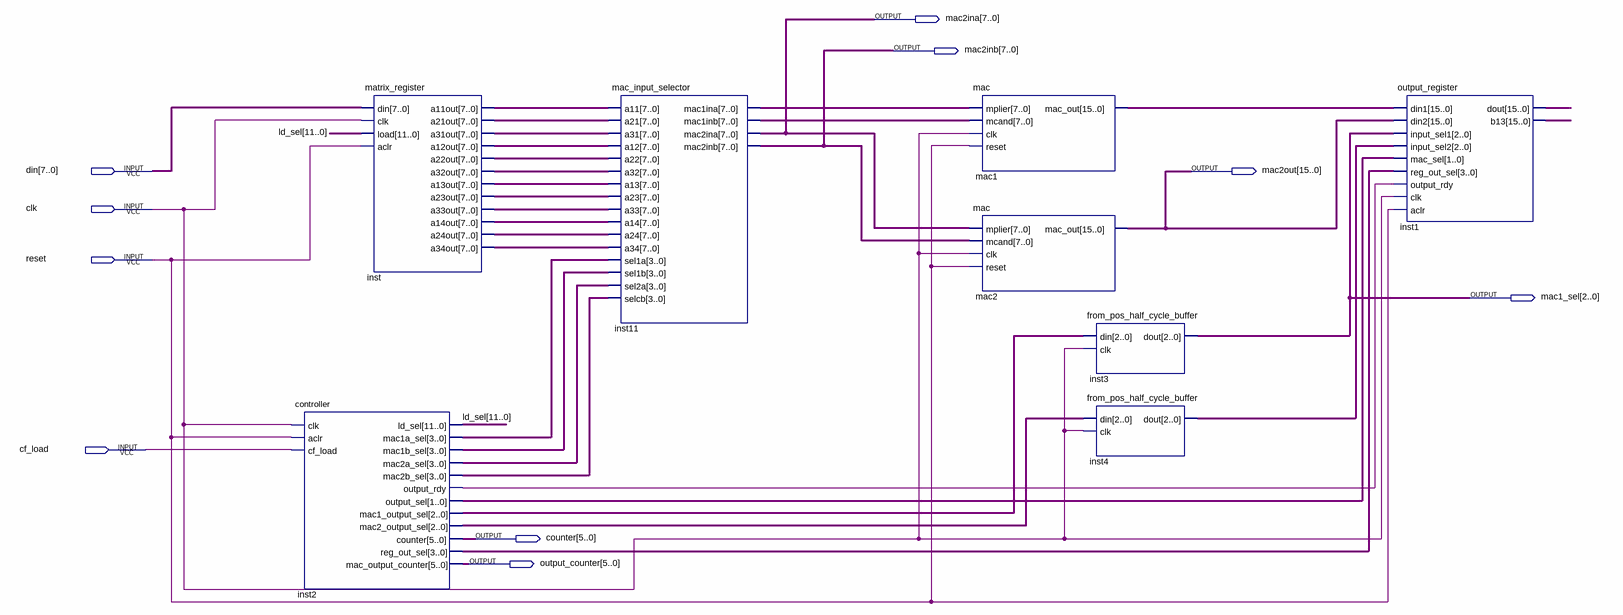
[diagram p0: schematic sheet]
// Quartus schematic transmult.bdf as structural Verilog: 8 symbols, 10 pins
module transmult (
  input  [7:0] din,
  input  clk,
  input  reset,
  input  cf_load,
  output [7:0] mac2ina,
  output [7:0] mac2inb,
  output [15:0] mac2out,
  output [2:0] mac1_sel,
  output [5:0] counter,
  output [5:0] output_counter
);

  wire inst2_output_rdy;
  wire [1:0] inst2_output_sel;
  wire [2:0] inst2_mac1_output_sel, inst2_mac2_output_sel, inst4_dout;
  wire [3:0] inst2_mac1a_sel, inst2_mac1b_sel, inst2_mac2a_sel, inst2_mac2b_sel, inst2_reg_out_sel;
  wire [7:0] inst11_mac1ina, inst11_mac1inb, inst_a11out, inst_a12out, inst_a13out, inst_a14out, inst_a21out,
       inst_a22out, inst_a23out, inst_a24out, inst_a31out, inst_a32out, inst_a33out, inst_a34out;
  wire [11:0] ld_sel;
  wire [15:0] inst1_b13, inst1_dout, mac1_mac_out;

  controller inst2 (
    .clk(clk), .aclr(reset), .cf_load(cf_load), .ld_sel(ld_sel), .mac1a_sel(inst2_mac1a_sel),
    .mac1b_sel(inst2_mac1b_sel), .mac2a_sel(inst2_mac2a_sel), .mac2b_sel(inst2_mac2b_sel),
    .output_rdy(inst2_output_rdy), .output_sel(inst2_output_sel), .mac1_output_sel(inst2_mac1_output_sel),
    .mac2_output_sel(inst2_mac2_output_sel), .counter(counter), .reg_out_sel(inst2_reg_out_sel),
    .mac_output_counter(output_counter));
  matrix_register inst (
    .din(din), .clk(clk), .load(ld_sel), .aclr(reset), .a11out(inst_a11out), .a21out(inst_a21out),
    .a31out(inst_a31out), .a12out(inst_a12out), .a22out(inst_a22out), .a32out(inst_a32out),
    .a13out(inst_a13out), .a23out(inst_a23out), .a33out(inst_a33out), .a14out(inst_a14out),
    .a24out(inst_a24out), .a34out(inst_a34out));
  mac_input_selector inst11 (
    .a11(inst_a11out), .a21(inst_a21out), .a31(inst_a31out), .a12(inst_a12out), .a22(inst_a22out),
    .a32(inst_a32out), .a13(inst_a13out), .a23(inst_a23out), .a33(inst_a33out), .a14(inst_a14out),
    .a24(inst_a24out), .a34(inst_a34out), .sel1a(inst2_mac1a_sel), .sel1b(inst2_mac1b_sel),
    .sel2a(inst2_mac2a_sel), .selcb(inst2_mac2b_sel), .mac1ina(inst11_mac1ina), .mac1inb(inst11_mac1inb),
    .mac2ina(mac2ina), .mac2inb(mac2inb));
  mac mac1 (.mplier(inst11_mac1ina), .mcand(inst11_mac1inb), .clk(clk), .reset(reset), .mac_out(mac1_mac_out));
  mac mac2 (.mplier(mac2ina), .mcand(mac2inb), .clk(clk), .reset(reset), .mac_out(mac2out));
  from_pos_half_cycle_buffer inst3 (.din(inst2_mac1_output_sel), .clk(clk), .dout(mac1_sel));
  from_pos_half_cycle_buffer inst4 (.din(inst2_mac2_output_sel), .clk(clk), .dout(inst4_dout));
  output_register inst1 (
    .din1(mac1_mac_out), .din2(mac2out), .input_sel1(mac1_sel), .input_sel2(inst4_dout),
    .mac_sel(inst2_output_sel), .reg_out_sel(inst2_reg_out_sel), .output_rdy(inst2_output_rdy), .clk(clk),
    .aclr(reset), .dout(inst1_dout), .b13(inst1_b13));
endmodule
